# EAGLE design drivepod_dsub (EAGLE 7.2.0)
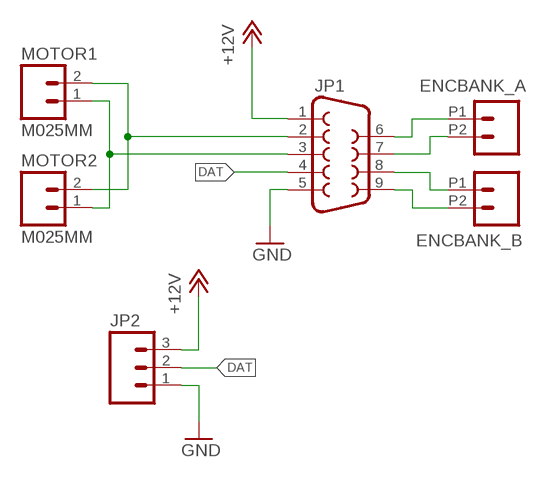
[diagram p0: schematic, sheet 1]

## Parts
ENCBANK_A  M022.54MM_SCREWTERM  [1X02_2.54_SCREWTERM]
ENCBANK_B  M022.54MM_SCREWTERM  [1X02_2.54_SCREWTERM]
JP1  DB9MALE  [DB9_MALE]
JP2  M03SCREW  [SCREWTERMINAL-3.5MM-3]
MOTOR1  M025MM  [SCREWTERMINAL-5MM-2]
MOTOR2  M025MM  [SCREWTERMINAL-5MM-2]

## Nets
+12V: JP1.1 JP2.3
DAT: JP1.4 JP2.2
GND: JP1.5 JP2.1
N$1: JP1.2 MOTOR1.2 MOTOR2.2
N$2: JP1.3 MOTOR1.1 MOTOR2.1
N$3: ENCBANK_B.P1 JP1.8
N$5: ENCBANK_B.P2 JP1.9
N$6: ENCBANK_A.P1 JP1.6
N$7: ENCBANK_A.P2 JP1.7

## Library data of the parts
ENCBANK_A ENCBANK_B = SparkFun-Connectors:M02: Standard 2-pin 0.1" header. Use with - straight break away headers ( PRT-00116) - right angle break away headers (PRT-00553) - swiss pins (PRT-00743) - machine pins (PRT-00117) - female headers (PRT-00115) Molex polarized connector foot print use with: PRT-08233 with associated crimp pins and housings. 2.54_SCREWTERM for use with PRT-10571. 3.5mm Screw Terminal footprints for PRT-08084 5mm Screw Terminal footprints for use with PRT-08432
JP1 = SparkFun-Connectors:DB9: DB9 Connector Standard DB9 (D-Sub 9) serial connector. Can be used for CAN bus as well as RS485 and RS232. Footprint production proven. Spark Fun Electronics SKU : PRT-00429; PROD_ID: CONN-09904
JP2 = SparkFun-Connectors:M03: Header 3 Standard 3-pin 0.1" header. Use with straight break away headers (SKU : PRT-00116), right angle break away headers (PRT-00553), swiss pins (PRT-00743), machine pins (PRT-00117), and female headers (PRT-00115). Molex polarized connector foot print use with SKU : PRT-08232 with associated crimp pins and housings.
MOTOR1 MOTOR2 = SparkFun-Connectors:M02: Standard 2-pin 0.1" header. Use with - straight break away headers ( PRT-00116) - right angle break away headers (PRT-00553) - swiss pins (PRT-00743) - machine pins (PRT-00117) - female headers (PRT-00115) Molex polarized connector foot print use with: PRT-08233 with associated crimp pins and housings. 2.54_SCREWTERM for use with PRT-10571. 3.5mm Screw Terminal footprints for PRT-08084 5mm Screw Terminal footprints for use with PRT-08432; STOREFRONT_ID: PRT-08432

## Board
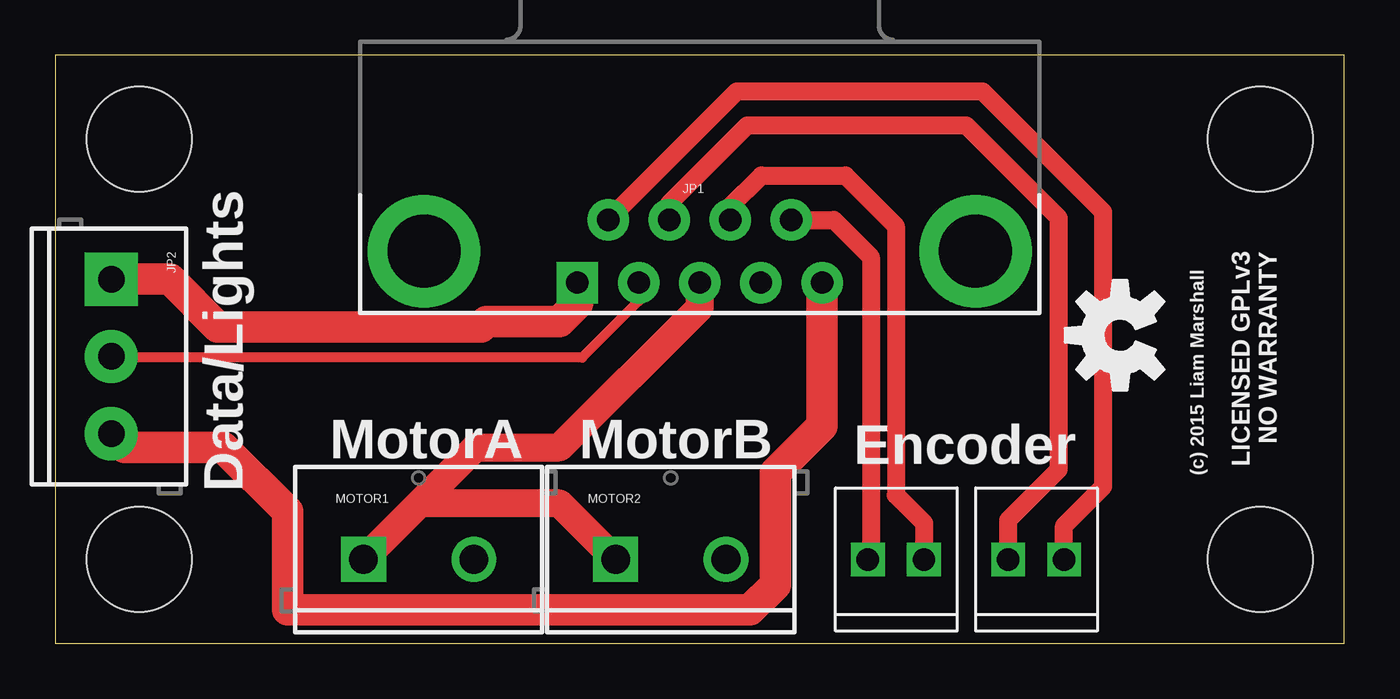
[diagram p1: board, top side]
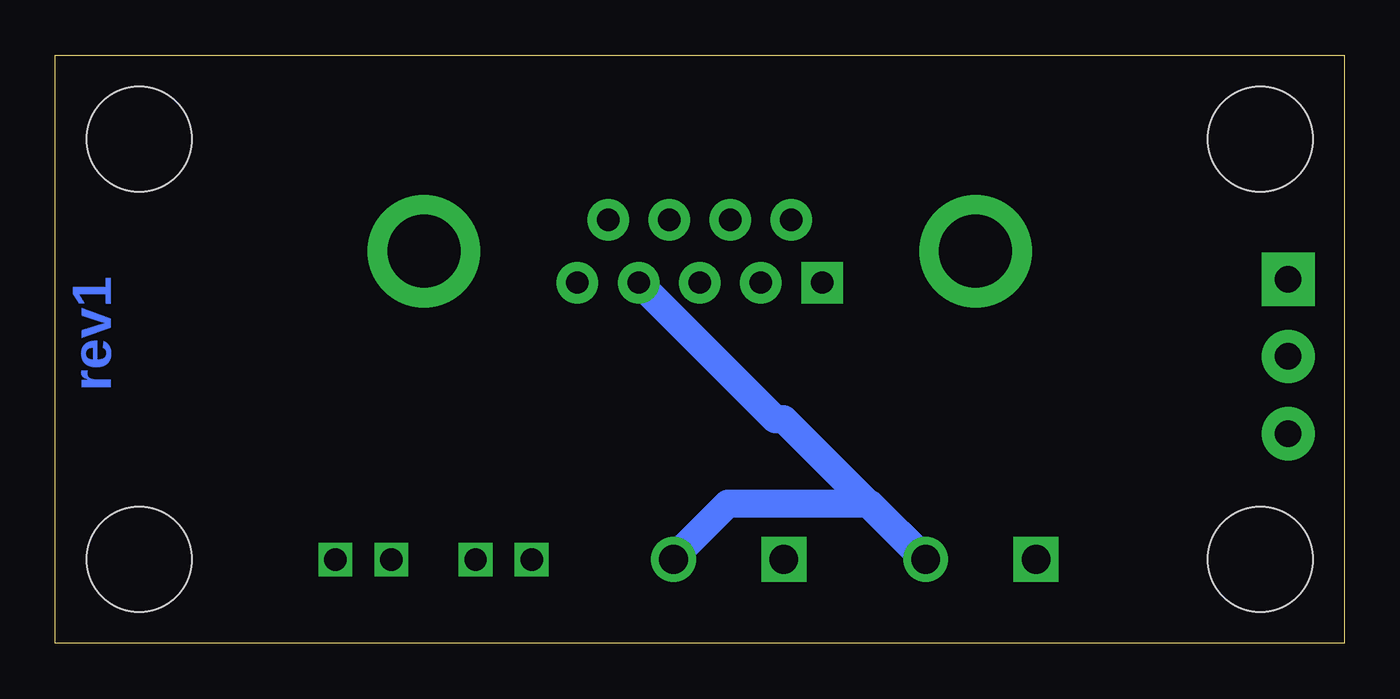
[diagram p2: board, bottom side, seen from below]

Size 58.42 x 26.67 mm. Coordinates in mm from the lower left corner, seen from the top.
Outline: 0,0 58.42,0 58.42,26.67 0,26.66 0,0
Copper layers (1*16): Top 0.0356mm / dielectric 1.5011mm / Bottom 0.0356mm
Design rules "oshpark-2layer": minimum track width 6mil, minimum drill 13mil, track to track 6mil, track to pad 6mil, pad to pad 6mil, via to via 6mil, smd to smd 6mil, copper to edge 15mil, drill to drill 6mil, minimum pad ring 7mil, minimum via ring 7mil, stop-mask expansion 4mil, vias tented up to drill 0mil, thermal gap 10mil
Holes 4.76 mm at 3.81,3.81 3.81,22.86 54.61,22.86 54.61,3.81

### Footprints (pad centres in the part's own frame; a part is rotated, then mirrored left to right if it is on the bottom)
1X02_2.54_SCREWTERM = drill 1.016 square: P1 2.54,0; P2 0,0
DB9_MALE = drill 1.016 pad 1.88: 1 5.54,-1.42; 2 2.77,-1.42; 3 0,-1.42; 4 -2.77,-1.42; 6 4.15,1.42; 7 1.38,1.42; 8 -1.38,1.42; 9 -4.15,1.42 | drill 1.016 pad 1.88 square: 5 -5.54,-1.42 | drill 3.302 pad 5.08: G1 -12.5,0; G2 12.5,0
SCREWTERMINAL-3.5MM-3 = drill 1.2 pad 2.413 square: 1 0,0 | drill 1.2 pad 2.413: 2 3.5,0; 3 7,0
SCREWTERMINAL-5MM-2 = drill 1.3 pad 2.032 square: 1 0,0 | drill 1.3 pad 2.032: 2 5,0

### Placement (x,y rotation side)
ENCBANK_A  39.37,3.81 180 top
ENCBANK_B  45.72,3.81 180 top
JP1  29.21,17.78 0 top
JP2  2.54,16.51 270 top
MOTOR1  13.97,3.81 0 top
MOTOR2  25.4,3.81 0 top
U$1  [OSHW-LOGO-M]  48.26,13.97 90 top

### Tracks (layer width: path | path; a pad name or v marks a point on that pad's centre or on a via)
+12V
  Top 1.422: JP1.1 34.75,9.86 32.64,7.75 32.64,2.67 31.5,1.52 10.53,1.52 10.53,5.98 7.62,8.89 3.16,8.89 JP2.3
DAT
  Top 0.457: JP1.4 26.44,15.52 23.88,12.95 2.6,12.95 JP2.2
GND
  Top 1.422: JP1.5 23.67,15.41 22.86,14.61 19.56,14.61 19.3,14.35 7.37,14.35 5.21,16.51 JP2.1
N$1
  Bottom 1.27: MOTOR2.2 30.4,3.89 27.94,6.35 21.51,6.35 MOTOR1.2 19.05,3.81 25.4,10.16 25.78,10.16 JP1.2
N$2
  Top 1.27: MOTOR2.1 22.86,6.35 16.51,6.35 MOTOR1.1 19.05,8.89 22.86,8.89 29.21,15.24 JP1.3
N$3
  Top 0.813: JP1.8 27.83,19.96 31.37,23.5 41.27,23.5 45.47,19.3 45.47,7.87 43.18,5.59 ENCBANK_B.P1
N$5
  Top 0.813: ENCBANK_B.P2 45.72,5.33 47.5,7.11 47.5,19.56 42.04,25.02 30.88,25.02 JP1.9
N$6
  Top 0.813: JP1.6 35.28,19.2 36.96,17.53 36.96,3.94 ENCBANK_A.P1
N$7
  Top 0.813: JP1.7 30.59,19.8 32,21.21 35.81,21.21 38.1,18.92 38.1,6.73 39.37,5.46 ENCBANK_A.P2

### Text on the board
Bottom: rev1
tPlace: Data/Lights | LICENSED GPLv3 / NO WARRANTY | MotorA | MotorB | Encoder | (c) 2015 Liam Marshall
bStop: rev1